# EAGLE schematic PCB-ARD-XTD1 (EAGLE 6.4)
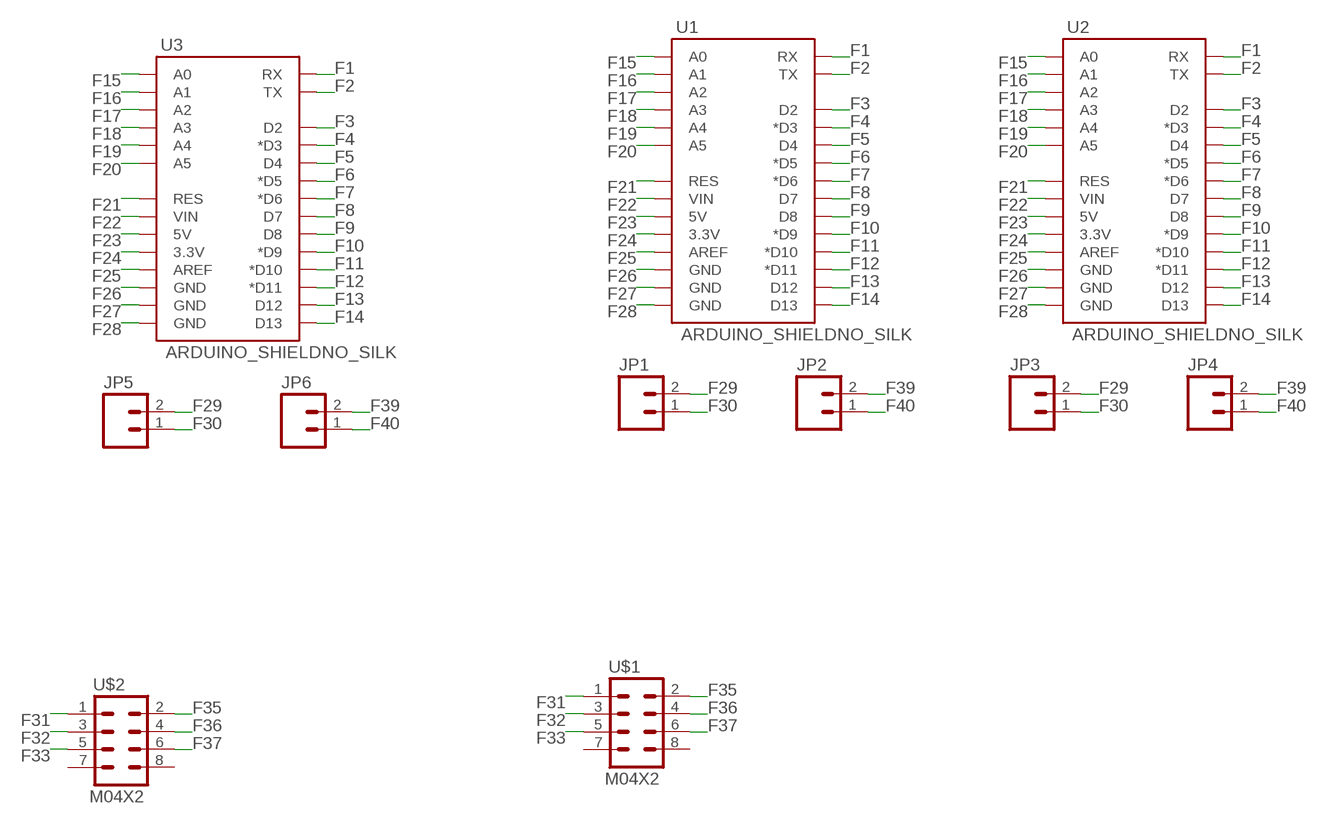
[diagram p0: schematic, sheet 1]

## Parts
JP1  M02PTH  [1X02]
JP2  M02PTH  [1X02]
JP3  M02PTH  [1X02]
JP4  M02PTH  [1X02]
JP5  M02PTH  [1X02]
JP6  M02PTH  [1X02]
U1  ARDUINO_SHIELDNO_SILK  [DUEMILANOVE_VIAS]
U2  ARDUINO_SHIELDNO_SILK  [DUEMILANOVE_VIAS]
U3  ARDUINO_SHIELDNO_SILK  [DUEMILANOVE_VIAS]
U$1  M04X2  [2X4]
U$2  M04X2  [2X4]

## Nets
F1: U1.RX U2.RX U3.RX
F2: U1.TX U2.TX U3.TX
F3: U1.D2 U2.D2 U3.D2
F4: U1.D3(*D3) U2.D3(*D3) U3.D3(*D3)
F5: U1.D4 U2.D4 U3.D4
F6: U1.D5(*D5) U2.D5(*D5) U3.D5(*D5)
F7: U1.D6(*D6) U2.D6(*D6) U3.D6(*D6)
F8: U1.D7 U2.D7 U3.D7
F9: U1.D8 U2.D8 U3.D8
F10: U1.D9(*D9) U2.D9(*D9) U3.D9(*D9)
F11: U1.D10(*D10) U2.D10(*D10) U3.D10(*D10)
F12: U1.D11(*D11) U2.D11(*D11) U3.D11(*D11)
F13: U1.D12 U2.D12 U3.D12
F14: U1.D13 U2.D13 U3.D13
F15: U1.A0 U2.A0 U3.A0
F16: U1.A1 U2.A1 U3.A1
F17: U1.A2 U2.A2 U3.A2
F18: U1.A3 U2.A3 U3.A3
F19: U1.A4 U2.A4 U3.A4
F20: U1.A5 U2.A5 U3.A5
F21: U1.RES U2.RES U3.RES
F22 [Power]: U1.VIN U2.VIN U3.VIN
F23 [Power]: U1.5V U2.5V U3.5V
F24 [Power]: U1.3.3V U2.3.3V U3.3.3V
F25: U1.AREF U2.AREF U3.AREF
F26 [Power]: U1.GND@2(GND) U2.GND@2(GND) U3.GND@2(GND)
F27 [Power]: U1.GND@1(GND) U2.GND@1(GND) U3.GND@1(GND)
F28 [Power]: U1.GND@0(GND) U2.GND@0(GND) U3.GND@0(GND)
F29: JP1.2 JP3.2 JP5.2
F30: JP1.1 JP3.1 JP5.1
F31: U$1.1 U$2.1
F32: U$1.3 U$2.3
F33: U$1.5 U$2.5
F35: U$1.2 U$2.2
F36: U$1.4 U$2.4
F37: U$1.6 U$2.6
F39: JP2.2 JP4.2 JP6.2
F40: JP2.1 JP4.1 JP6.1
Unconnected: U$1.7 U$1.8 U$2.7 U$2.8

## Library data of the parts
JP1-JP6 = SparkFun:M02: Header 2 Standard 2-pin 0.1" header. Use with straight break away headers (SKU : PRT-00116), right angle break away headers (PRT-00553), swiss pins (PRT-00743), machine pins (PRT-00117), and female headers (PRT-00115). Molex polarized connector foot print use with SKU : PRT-08233 with associated crimp pins and housings.
U1-U3 = SparkFun:ARDUINO_SHIELD
U$1 U$2 = SparkFun:M04X2

## Net classes
0 default: width 0.203 mm, drill 0.406 mm, clearance 0.203 mm
1 Power: width 0.406 mm, drill 0.61 mm, clearance 0.406 mm